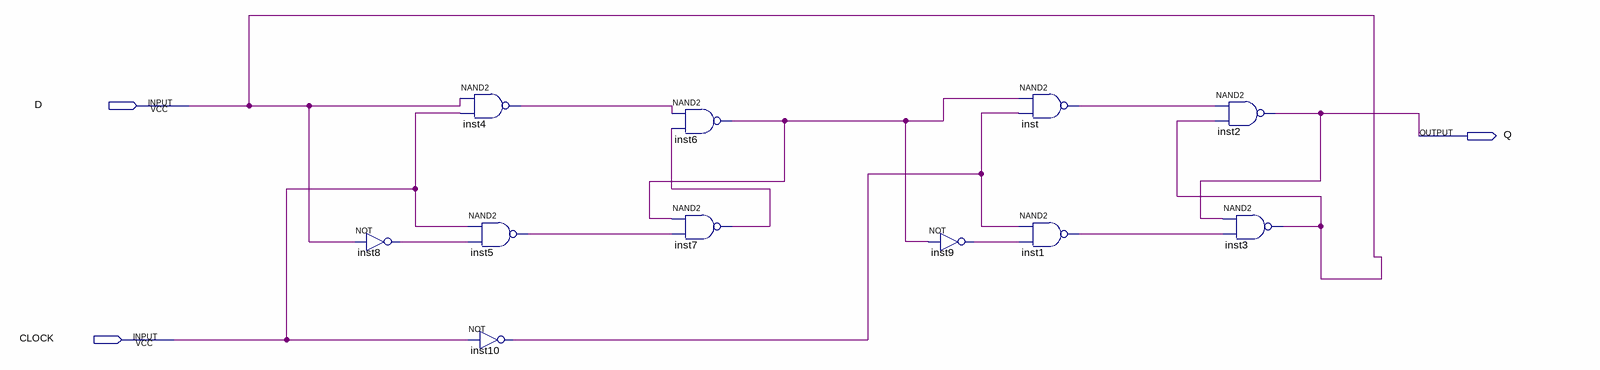
[diagram p0: schematic sheet]
// Quartus schematic Block2.bdf as structural Verilog: 11 symbols, 3 pins
module Block2 (
  input  D,
  input  CLOCK,
  output Q
);

  wire inst1_out, inst4_out, inst5_out, inst6_out, inst7_out, inst8_out, inst9_out, inst10_out, inst_out;

  not inst8 (inst8_out, D);
  nand inst4 (inst4_out, D, CLOCK);
  nand inst5 (inst5_out, CLOCK, inst8_out);
  not inst10 (inst10_out, CLOCK);
  nand inst6 (inst6_out, inst4_out, inst7_out);
  nand inst7 (inst7_out, inst6_out, inst5_out);
  not inst9 (inst9_out, inst6_out);
  nand inst (inst_out, inst6_out, inst10_out);
  nand inst1 (inst1_out, inst10_out, inst9_out);
  nand inst2 (Q, inst_out, D);
  nand inst3 (D, Q, inst1_out);
endmodule
